# Altium project HAB-Main-Flight-Computer-Card-Template.PrjPcb (part 4 of 4)

## Sheet Power-Supplies.SchDoc
size A2; Organization: Altium Limited; Address1: L3, 12a Rodborough Rd; Address2: Frenchs Forest; Address3: NSW; Address4: Australia 2086
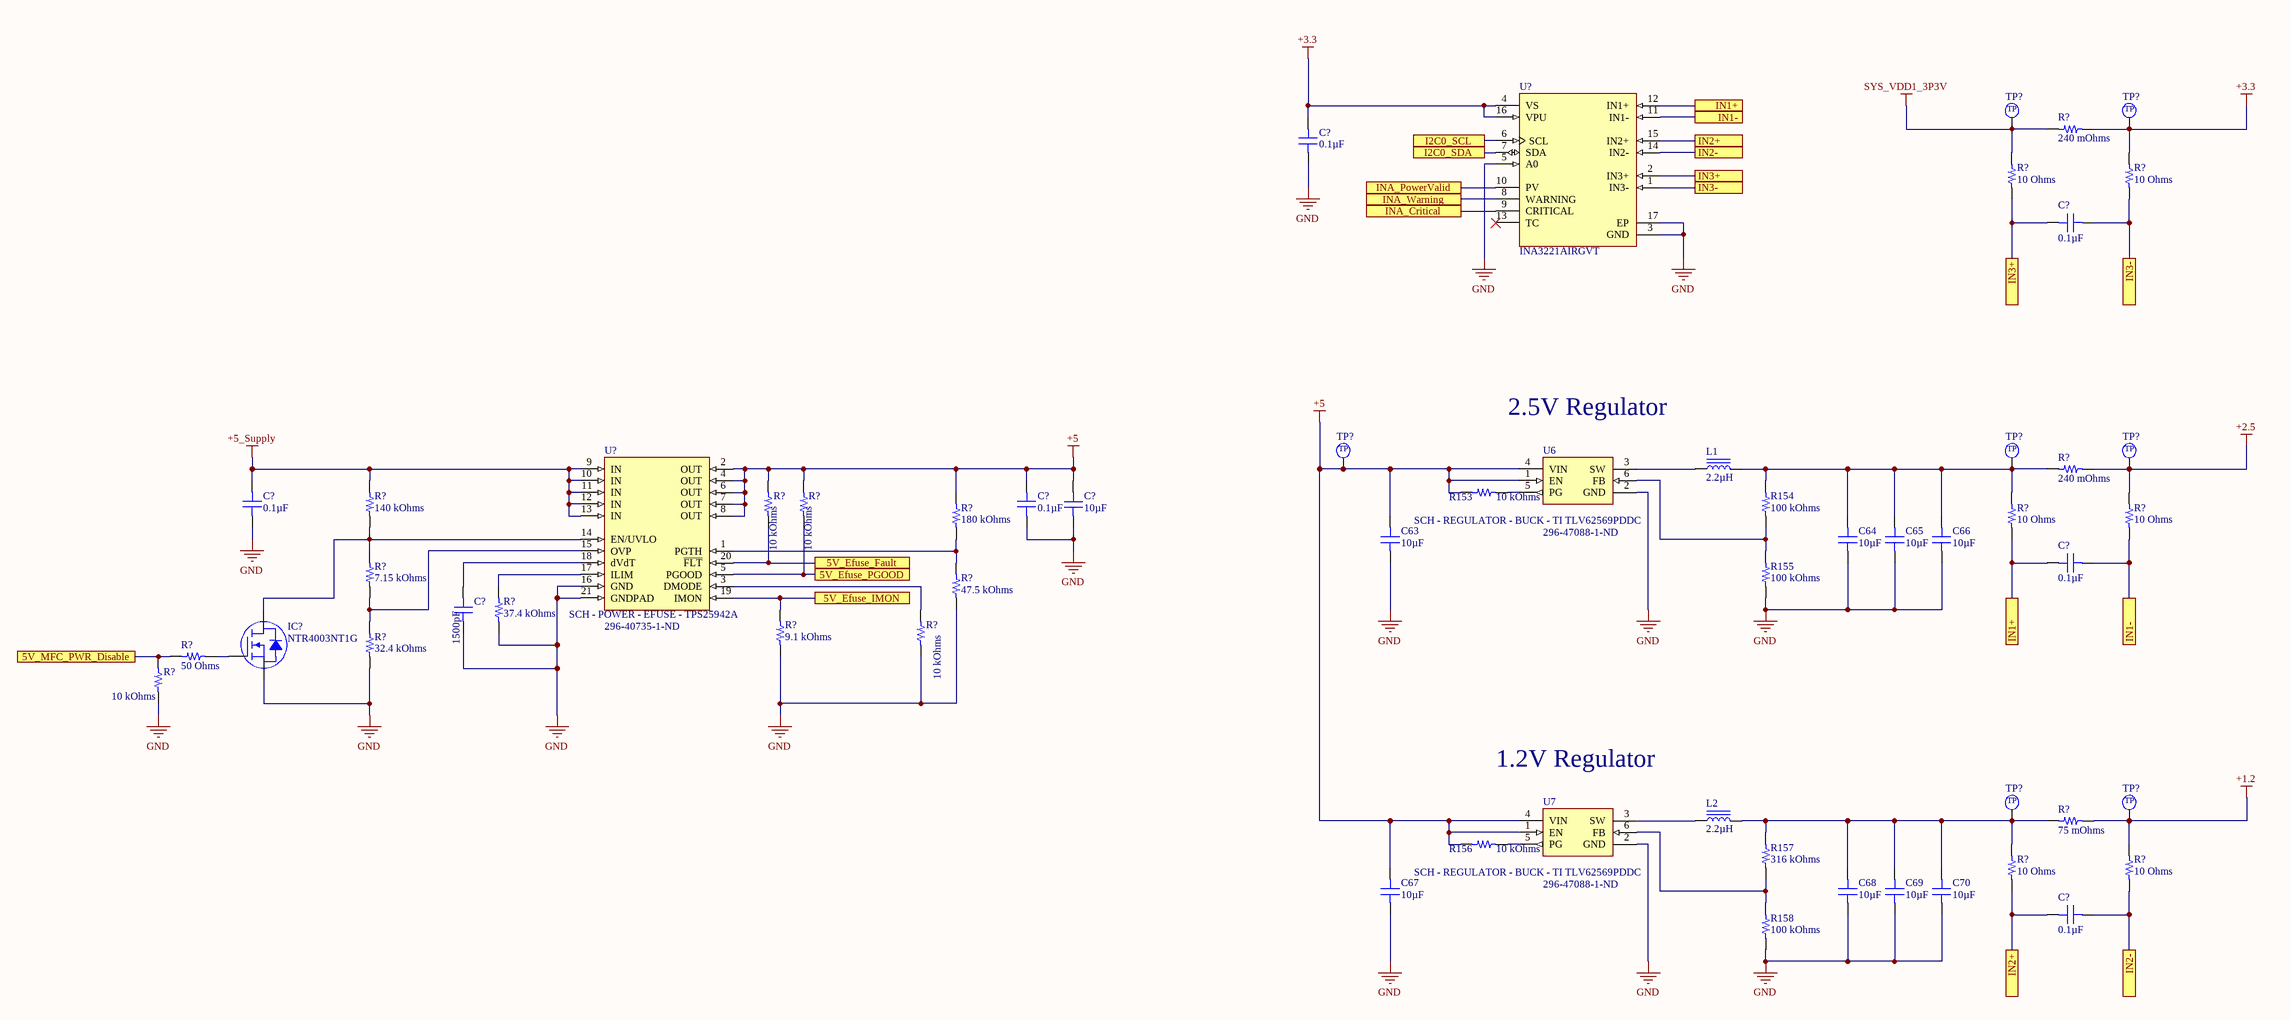
[diagram p8: Power-Supplies.SchDoc]

### Parts
(Parts that share a designator on the sheet are numbered #1, #2 ... from top to bottom, then left to right.)
C63  10µF  [CAP 0805_2012]
C64  10µF  [CAP 0805_2012]
C65  10µF  [CAP 0805_2012]
C66  10µF  [CAP 0805_2012]
C67  10µF  [CAP 0805_2012]
C68  10µF  [CAP 0805_2012]
C69  10µF  [CAP 0805_2012]
C70#2  10µF  [CAP 0805_2012]
C?#9  0.1µF  [CAP 0603_1608]
C?#10  0.1µF  [CAP 0603_1608]
C?#11  0.1µF  [CAP 0603_1608]
C?#12  0.1µF  [CAP 0603_1608]
C?#13  10µF  [CAP 0805_2012]
C?#14  0.1µF  [CAP 0603_1608]
C?#15  1500pF  [CAP 0603_1608]
C?#16  0.1µF  [CAP 0603_1608]
IC?  NTR4003NT1G  [ON SEMI SOT-23-3]
L1  2.2µH  [BOURNS SRN4018]
L2  2.2µH  [BOURNS SRN4018]
R153  10 kOhms  [RES 0603_1608]
R154  100 kOhms  [RES 0603_1608]
R155  100 kOhms  [RES 0603_1608]
R156  10 kOhms  [RES 0603_1608]
R157  316 kOhms  [RES 0603_1608]
R158  100 kOhms  [RES 0603_1608]
R?#10  240 mOhms  [RES 0805_2012]
R?#11  10 Ohms  [RES 0603_1608]
R?#12  10 Ohms  [RES 0603_1608]
R?#13  240 mOhms  [RES 0805_2012]
R?#14  140 kOhms  [RES 0603_1608]
R?#15  10 kOhms  [RES 0603_1608]
R?#16  10 kOhms  [RES 0603_1608]
R?#17  180 kOhms  [RES 0603_1608]
R?#18  10 Ohms  [RES 0603_1608]
R?#19  10 Ohms  [RES 0603_1608]
R?#20  7.15 kOhms  [RES 0603_1608]
R?#21  47.5 kOhms  [RES 0603_1608]
R?#22  37.4 kOhms  [RES 0603_1608]
R?#23  9.1 kOhms  [RES 0603_1608]
R?#24  10 kOhms  [RES 0603_1608]
R?#25  32.4 kOhms  [RES 0603_1608]
R?#26  50 Ohms  [RES 0603_1608]
R?#27  10 kOhms  [RES 0603_1608]
R?#28  75 mOhms  [RES 0805_2012]
R?#29  10 Ohms  [RES 0603_1608]
R?#30  10 Ohms  [RES 0603_1608]
TP?#1  2.5mm_SMD_TestPoint  [2.5mm TestPoint]  (value not drawn)
TP?#2  2.5mm_SMD_TestPoint  [2.5mm TestPoint]  (value not drawn)
TP?#3  2.5mm_SMD_TestPoint  [2.5mm TestPoint]  (value not drawn)
TP?#4  2.5mm_SMD_TestPoint  [2.5mm TestPoint]  (value not drawn)
TP?#5  2.5mm_SMD_TestPoint  [2.5mm TestPoint]  (value not drawn)
TP?#6  2.5mm_SMD_TestPoint  [2.5mm TestPoint]  (value not drawn)
TP?#7  2.5mm_SMD_TestPoint  [2.5mm TestPoint]  (value not drawn)
U6  SCH - REGULATOR - BUCK - TI TLV62569PDDC  Supplier Part Number 1: 296-47088-1-ND  [PCB - LEADS - SOT- TI TSOT-23-6]
U7  SCH - REGULATOR - BUCK - TI TLV62569PDDC  Supplier Part Number 1: 296-47088-1-ND  [PCB - LEADS - SOT- TI TSOT-23-6]
U?#2  INA3221AIRGVT  [RGV0016A_V]
U?#3  SCH - POWER - EFUSE - TPS25942A  Supplier Part Number 1: 296-40735-1-ND  [PCB - LEADLESS - QFN - TI 20-WQFN]

### Ports
5V_Efuse_Fault, 5V_Efuse_IMON, 5V_Efuse_PGOOD, 5V_MFC_PWR_Disable, I2C0_SCL, I2C0_SDA, IN1+, IN1-, IN2+, IN2-, IN3+, IN3-, INA_Critical, INA_PowerValid, INA_Warning

### Nets
+1.2: R?#28.2 R?#30.2 TP?#7.1
+2.5: R?#13.2 R?#19.2 TP?#5.1
+3.3: C?#9.2 R?#10.2 R?#12.2 TP?#2.1 U?#2.4(VS) U?#2.16(VPU)
+5: C63.2 C67.2 C?#12.2 C?#13.2 R153.2 R156.2 R?#15.2 R?#16.2 R?#17.2 TP?#3.1 U6.1(EN) U6.4(VIN) U7.1(EN) U7.4(VIN) U?#3.2(OUT) U?#3.4(OUT) U?#3.6(OUT) U?#3.7(OUT) U?#3.8(OUT)
+5_Supply: C?#11.2 R?#14.2 U?#3.9(IN) U?#3.10(IN) U?#3.11(IN) U?#3.12(IN) U?#3.13(IN)
GND: C63.1 C64.1 C65.1 C66.1 C67.1 C68.1 C69.1 C70#2.1 C?#9.1 C?#11.1 C?#12.1 C?#13.1 C?#15.1 IC?.2(S) R155.1 R158.1 R?#21.1 R?#22.1 R?#23.1 R?#24.1 R?#25.1 R?#27.1 U6.2(GND) U7.2(GND) U?#2.3(GND) U?#2.5(A0) U?#2.17(EP) U?#3.16(GND) U?#3.21(GNDPAD)
SYS_VDD1_3P3V: R?#10.1 R?#11.2 TP?#1.1
NetC64_2: C64.2 C65.2 C66.2 L1.2 R154.2 R?#13.1 R?#18.2 TP?#4.1
NetC68_2: C68.2 C69.2 C70#2.2 L2.2 R157.2 R?#28.1 R?#29.2 TP?#6.1
NetC?#10_1: C?#10.1 R?#12.1 U?#2.1(IN3-) ; port IN3-
NetC?#10_2: C?#10.2 R?#11.1 U?#2.2(IN3+) ; port IN3+
NetC?#14_1: C?#14.1 R?#19.1 U?#2.11(IN1-) ; port IN1-
NetC?#14_2: C?#14.2 R?#18.1 U?#2.12(IN1+) ; port IN1+
NetC?#15_2: C?#15.2 U?#3.18(dVdT)
NetC?#16_1: C?#16.1 R?#30.1 U?#2.14(IN2-) ; port IN2-
NetC?#16_2: C?#16.2 R?#29.1 U?#2.15(IN2+) ; port IN2+
NetIC?_1: IC?.1(G) R?#26.1
NetIC?_3: IC?.3(D) R?#14.1 R?#20.2 U?#3.14(EN/UVLO)
NetL1_1: L1.1 U6.3(SW)
NetL2_1: L2.1 U7.3(SW)
NetR153_1: R153.1 U6.5(PG)
NetR154_1: R154.1 R155.2 U6.6(FB)
NetR156_1: R156.1 U7.5(PG)
NetR157_1: R157.1 R158.2 U7.6(FB)
NetR?#15_1: R?#15.1 U?#3.20(~{FLT}) ; port 5V_Efuse_Fault
NetR?#16_1: R?#16.1 U?#3.5(PGOOD) ; port 5V_Efuse_PGOOD
NetR?#17_1: R?#17.1 R?#21.2 U?#3.1(PGTH)
NetR?#20_1: R?#20.1 R?#25.2 U?#3.15(OVP)
NetR?#22_2: R?#22.2 U?#3.17(ILIM)
NetR?#23_2: R?#23.2 U?#3.19(IMON) ; port 5V_Efuse_IMON
NetR?#24_2: R?#24.2 U?#3.3(DMODE)
NetR?#26_2: R?#26.2 R?#27.2 ; port 5V_MFC_PWR_Disable
NetU?#2_6: U?#2.6(SCL) ; port I2C0_SCL
NetU?#2_7: U?#2.7(SDA) ; port I2C0_SDA
NetU?#2_8: U?#2.8(WARNING) ; port INA_Warning
NetU?#2_9: U?#2.9(CRITICAL) ; port INA_Critical
NetU?#2_10: U?#2.10(PV) ; port INA_PowerValid

Not connected (* = marked no-connect by the designer): U?#2 13(TC)*

### Notes on the sheet
- 2.5V Regulator
- 1.2V Regulator
- Title
- Size:
- Date:
- File:
- A2
- Number:
- Time:
- Revision:
- Sheet
- of
- (in symbol 2.5mm_SMD_TestPoint) TP

### Library data of the parts
C63-C69 C70#2 C?#13 = CC0805KKX5R7BB106: CAP CER 10UF 16V X5R 0805; Manufacturer: Yageo; Tolerance: ±10%; Part Number: CC0805KKX5R7BB106; Value: 10µF; Applications: General Purpose; Capacitance: 10µF; ComponentLink1Description: Datasheet; ComponentLink1URL: https://www.yageo.com/upload/media/product/productsearch/datasheet/mlcc/UPY-GPHC_X5R_4V-to-50V_25.pdf; ComponentLink2Description: DigiKey Link; ComponentLink2URL: http://digikey.com/product-detail/en/yageo/CC0805KKX5R7BB106/311-1865-1-ND/5195767; Device Package: 0805 (2012 Metric); LastUpdated: 9/2/2020 1:04:30 AM; Lifecycle Status: Active; Minimum Order: 1; Mounting Type: Surface Mount, MLCC; Operating Temperature: -55°C ~ 85°C; Package / Case: 0805 (2012 Metric); Packaging: TapeAndReel; PartId: 8867; Part Status: Active; Price: 0.09; Series: CC; Size / Dimension: 0.079" L x 0.049" W (2.00mm x 1.25mm); Supplier 1: DigiKey; Supplier Part Number 1: 311-1865-1-ND; Temperature Coefficient: X5R; Thickness (Max): 0.057" (1.45mm); Voltage - Rated: 16V
C?#9-C?#12 C?#14 C?#16 = CL10B104KA8WPNC: CAP CER 0.1UF 25V X7R 0603; Manufacturer: Samsung Electro-Mechanics; Tolerance: ±10%; Part Number: CL10B104KA8WPNC; Value: 0.1µF; Applications: Automotive; Capacitance: 0.1µF; ComponentLink1Description: Datasheet; ComponentLink1URL: http://www.samsungsem.com/kr/support/product-search/mlcc/CL10B104KA8WPNC.jsp; ComponentLink2Description: DigiKey Link; ComponentLink2URL: http://digikey.com/product-detail/en/samsung-electro-mechanics/CL10B104KA8WPNC/1276-6717-1-ND/5961576; Device Package: 0603 (1608 Metric); Features: Open Mode; LastUpdated: 9/2/2020 1:03:30 AM; Lifecycle Status: Active; Minimum Order: 1; Mounting Type: Surface Mount, MLCC; Operating Temperature: -55°C ~ 125°C; Package / Case: 0603 (1608 Metric); Packaging: TapeAndReel; PartId: 5631; Part Status: Active; Price: 0.02; Ratings: AEC-Q200; Series: CL; Size / Dimension: 0.063" L x 0.031" W (1.60mm x 0.80mm); Supplier 1: DigiKey; Supplier Part Number 1: 1276-6717-1-ND; Temperature Coefficient: X7R; Thickness (Max): 0.035" (0.90mm); Voltage - Rated: 25V
C?#15 = CC0603JRX7R8BB152: CAP CER 1500PF 25V X7R 0603; Manufacturer: Yageo; Tolerance: ±5%; Part Number: CC0603JRX7R8BB152; Value: 1500pF; Applications: General Purpose; Capacitance: 1500pF; ComponentLink1Description: Datasheet; ComponentLink1URL: https://www.yageo.com/upload/media/product/productsearch/datasheet/mlcc/UPY-GPHC_X7R_6.3V-to-50V_18.pdf; ComponentLink2Description: DigiKey Link; ComponentLink2URL: http://digikey.com/product-detail/en/yageo/CC0603JRX7R8BB152/311-3996-1-ND/8025085; Device Package: 0603 (1608 Metric); LastUpdated: 9/2/2020 1:03:18 AM; Lifecycle Status: Active; Minimum Order: 1; Mounting Type: Surface Mount, MLCC; Operating Temperature: -55°C ~ 125°C; Package / Case: 0603 (1608 Metric); Packaging: TapeAndReel; PartId: 12307; Part Status: Active; Price: 0.02; Series: CC; Size / Dimension: 0.063" L x 0.031" W (1.60mm x 0.80mm); Supplier 1: DigiKey; Supplier Part Number 1: 311-3996-1-ND; Temperature Coefficient: X7R; Thickness (Max): 0.035" (0.90mm); Voltage - Rated: 25V
IC? = NTR4003NT1G: MOSFET N-CH 30V 500MA SOT-23; Manufacturer: ON Semiconductor; Current - Continuous Drain (Id) @ 25°C: 500mA (Ta); Drive Voltage (Max Rds On,  Min Rds On): 2.5V, 4V; FET Type: N-Channel; Gate Charge (Qg) (Max) @ Vgs: 1.15nC @ 5V; Input Capacitance (Ciss) (Max) @ Vds: 21pF @ 5V; Power Dissipation (Max): 690mW (Ta); Rds On (Max) @ Id, Vgs: 1.5Ohm @ 10mA, 4V; Vgs (Max): ±20V; Vgs(th) (Max) @ Id: 1.4V @ 250µA; Part Number: NTR4003NT1G; ComponentLink1Description: Datasheet; ComponentLink1URL: http://www.onsemi.com/pub/Collateral/NTR4003N-D.PDF; ComponentLink2Description: DigiKey Link; ComponentLink2URL: http://digikey.com/product-detail/en/on-semiconductor/NTR4003NT1G/NTR4003NT1GOSCT-ND/1967270; Drain to Source Voltage (Vdss): 30V; LastUpdated: 9/2/2020 1:25:08 AM; Lifecycle Status: Active; Minimum Order: 1; Mounting Type: Surface Mount; Operating Temperature: -55°C ~ 150°C (TJ); Package / Case: TO-236-3, SC-59, SOT-23-3; Packaging: TapeAndReel; Part Status: Active; Price: 0.05; Series: -; Supplier 1: DigiKey; Supplier Part Number 1: NTR4003NT1GOSCT-ND; Supplier Device Package: SOT-23-3 (TO-236); Technology: MOSFET (Metal Oxide)
L1 L2 = SRN4018-2R2M: FIXED IND 2.2UH 2.9A 44 MOHM SMD; Manufacturer: Bourns Inc.; Current - Saturation: 3A; DC Resistance (DCR): 44mOhm Max; Frequency - Self Resonant: 60MHz; Inductance Frequency - Test: 100kHz; Material - Core: Ferrite; Q @ Freq: 9 @ 7.96MHz; Shielding: Semi-Shielded; Tolerance: ±20%; Type: Wirewound; Part Number: SRN4018-2R2M; ComponentLink1Description: Datasheet; ComponentLink1URL: https://www.bourns.com/docs/Product-Datasheets/SRN4018.pdf; ComponentLink2Description: DigiKey Link; ComponentLink2URL: http://digikey.com/product-detail/en/bourns-inc/SRN4018-2R2M/SRN4018-2R2MCT-ND/3821517; Current Rating (Amps): 2.9A; Device Package: Nonstandard; Height - Seated (Max): 0.071" (1.80mm); Inductance: 2.2µH; LastUpdated: 9/2/2020 1:30:23 AM; Lifecycle Status: Active; Minimum Order: 1; Mounting Type: Surface Mount; Operating Temperature: -40°C ~ 125°C; Package / Case: Nonstandard; Packaging: TapeAndReel; PartId: 3660; Part Status: Active; Price: 0.16; Series: SRN4018; Size / Dimension: 0.157" L x 0.157" W (4.00mm x 4.00mm); Supplier 1: DigiKey; Supplier Part Number 1: SRN4018-2R2MCT-ND; Value: 2.2µH
R153 R156 R?#15 R?#16 R?#24 R?#27 = RMCF0603JT10K0: RES 10K OHM 5% 1/10W 0603; Manufacturer: Stackpole Electronics Inc; Power (Watts): 0.1W, 1/10W; Temperature Coefficient: ±200ppm/°C; Part Number: RMCF0603JT10K0; Value: 10 kOhms; ComponentLink1Description: Datasheet; ComponentLink1URL: https://www.seielect.com/catalog/sei-packaging.pdf; ComponentLink2Description: DigiKey Link; ComponentLink2URL: http://digikey.com/product-detail/en/stackpole-electronics-inc/RMCF0603JT10K0/RMCF0603JT10K0CT-ND/1943191; Composition: Thick Film; Device Package: 0603 (1608 Metric); Features: Automotive AEC-Q200; Height - Seated (Max): 0.022" (0.55mm); LastUpdated: 8/30/2020 8:48:45 PM; Lifecycle Status: Active; Minimum Order: 1; Number of Terminations: 2; Operating Temperature: -55°C ~ 155°C; Package / Case: 0603 (1608 Metric); Packaging: CutTape; PartId: 25659; Part Status: Active; Price: 0.10; Ratings: AEC-Q200; Resistance: 10 kOhms; Series: RMCF; Size / Dimension: 0.061" L x 0.031" W (1.55mm x 0.80mm); Supplier 1: DigiKey; Supplier Part Number 1: RMCF0603JT10K0CT-ND; Supplier Device Package: 0603; Tolerance: ±5%
R154 R155 R158 = RMCF0603FT100K: RES 100K OHM 1% 1/10W 0603; Manufacturer: Stackpole Electronics Inc; Power (Watts): 0.1W, 1/10W; Temperature Coefficient: ±100ppm/°C; Part Number: RMCF0603FT100K; Value: 100 kOhms; ComponentLink1Description: Datasheet; ComponentLink1URL: https://www.seielect.com/catalog/sei-packaging.pdf; ComponentLink2Description: DigiKey Link; ComponentLink2URL: http://digikey.com/product-detail/en/stackpole-electronics-inc/RMCF0603FT100K/RMCF0603FT100KCT-ND/1943118; Composition: Thick Film; Device Package: 0603 (1608 Metric); Features: Automotive AEC-Q200; Height - Seated (Max): 0.022" (0.55mm); LastUpdated: 9/2/2020 1:09:31 AM; Lifecycle Status: Active; Minimum Order: 1; Number of Terminations: 2; Operating Temperature: -55°C ~ 155°C; Package / Case: 0603 (1608 Metric); Packaging: CutTape; PartId: 25664; Part Status: Active; Price: 0.10; Ratings: AEC-Q200; Resistance: 100 kOhms; Series: RMCF; Size / Dimension: 0.061" L x 0.031" W (1.55mm x 0.80mm); Supplier 1: DigiKey; Supplier Part Number 1: RMCF0603FT100KCT-ND; Supplier Device Package: 0603; Tolerance: ±1%
R157 = RMCF0603FT316K: RES 316K OHM 1% 1/10W 0603; Manufacturer: Stackpole Electronics Inc; Power (Watts): 0.1W, 1/10W; Temperature Coefficient: ±100ppm/°C; Part Number: RMCF0603FT316K; Value: 316 kOhms; ComponentLink1Description: Datasheet; ComponentLink1URL: https://www.seielect.com/catalog/sei-rmcf_rmcp.pdf; ComponentLink2Description: DigiKey Link; ComponentLink2URL: http://digikey.com/product-detail/en/stackpole-electronics-inc/RMCF0603FT316K/RMCF0603FT316KCT-ND/2418023; Composition: Thick Film; Device Package: 0603 (1608 Metric); Features: Automotive AEC-Q200; Height - Seated (Max): 0.022" (0.55mm); LastUpdated: 9/2/2020 1:09:52 AM; Lifecycle Status: Active; Minimum Order: 1; Number of Terminations: 2; Operating Temperature: -55°C ~ 155°C; Package / Case: 0603 (1608 Metric); Packaging: CutTape; PartId: 19849; Part Status: Active; Price: 0.10; Ratings: AEC-Q200; Resistance: 316 kOhms; Series: RMCF; Size / Dimension: 0.061" L x 0.031" W (1.55mm x 0.80mm); Supplier 1: DigiKey; Supplier Part Number 1: RMCF0603FT316KCT-ND; Supplier Device Package: 0603; Tolerance: ±1%
R?#10 R?#13 = KDV08FR240ET: RES 240M OHM 1% 1/4W 0805; Manufacturer: Ohmite; Power (Watts): 0.25W, 1/4W; Temperature Coefficient: ±50ppm/°C; Part Number: KDV08FR240ET; Value: 240 mOhms; ComponentLink1Description: Datasheet; ComponentLink1URL: https://www.ohmite.com/assets/docs/res_kdv.pdf?r=false; ComponentLink2Description: DigiKey Link; ComponentLink2URL: http://digikey.com/product-detail/en/ohmite/KDV08FR240ET/273-KDV08FR240ETCT-ND/10476983; Composition: Metal Film; Device Package: 0805 (2012 Metric); Features: Current Sense; Height - Seated (Max): 0.026" (0.65mm); LastUpdated: 9/2/2020 1:14:23 AM; Lifecycle Status: Active; Minimum Order: 1; Number of Terminations: 2; Operating Temperature: -55°C ~ 155°C; Package / Case: 0805 (2012 Metric); Packaging: TapeAndReel; PartId: 49831; Part Status: Active; Price: 0.03; Resistance: 240 mOhms; Series: KDV; Size / Dimension: 0.079" L x 0.049" W (2.00mm x 1.25mm); Supplier 1: DigiKey; Supplier Part Number 1: 273-KDV08FR240ETCT-ND; Supplier Device Package: 0805; Tolerance: ±1%
R?#11 R?#12 R?#18 R?#19 R?#29 R?#30 = CRGCQ0603F10R: CRGCQ 0603 10R 1%; Manufacturer: TE Connectivity Passive Product; Power (Watts): 0.1W, 1/10W; Temperature Coefficient: ±400ppm/°C; Part Number: CRGCQ0603F10R; Value: 10 Ohms; ComponentLink1Description: Datasheet; ComponentLink1URL: https://www.te.com/commerce/DocumentDelivery/DDEController?Action=srchrtrv&DocNm=1773204-3&DocType=DS&DocLang=English; ComponentLink2Description: DigiKey Link; ComponentLink2URL: http://digikey.com/product-detail/en/te-connectivity-passive-product/CRGCQ0603F10R/A129664CT-ND/8577496; Composition: Thick Film; Device Package: 0603 (1608 Metric); Features: Automotive AEC-Q200, Moisture Resistant; Height - Seated (Max): 0.022" (0.55mm); LastUpdated: 9/2/2020 1:09:39 AM; Lifecycle Status: Active; Minimum Order: 1; Number of Terminations: 2; Operating Temperature: -55°C ~ 155°C; Package / Case: 0603 (1608 Metric); Packaging: CutTape; PartId: 23975; Part Status: Active; Price: 0.10; Ratings: AEC-Q200; Resistance: 10 Ohms; Series: CRGCQ; Size / Dimension: 0.063" L x 0.031" W (1.60mm x 0.80mm); Supplier 1: DigiKey; Supplier Part Number 1: A129664CT-ND; Supplier Device Package: 0603; Tolerance: ±1%
R?#14 = RT0603BRE07140KL: RES SMD 140K OHM 0.1% 1/10W 0603; Manufacturer: Yageo; Power (Watts): 0.1W, 1/10W; Temperature Coefficient: ±50ppm/°C; Part Number: RT0603BRE07140KL; Value: 140 kOhms; ComponentLink1Description: Datasheet; ComponentLink1URL: https://www.yageo.com/upload/media/product/productsearch/datasheet/rchip/PYu-RT_1-to-0.01_RoHS_L_11.pdf; ComponentLink2Description: DigiKey Link; ComponentLink2URL: http://digikey.com/product-detail/en/yageo/RT0603BRE07140KL/YAG4626CT-ND/6616782; Composition: Thin Film; Device Package: 0603 (1608 Metric); Height - Seated (Max): 0.022" (0.55mm); LastUpdated: 9/2/2020 1:09:47 AM; Lifecycle Status: Active; Minimum Order: 1; Number of Terminations: 2; Operating Temperature: -55°C ~ 155°C; Package / Case: 0603 (1608 Metric); Packaging: TapeAndReel; PartId: 22168; Part Status: Active; Price: 0.05; Resistance: 140 kOhms; Series: RT; Size / Dimension: 0.063" L x 0.031" W (1.60mm x 0.80mm); Supplier 1: DigiKey; Supplier Part Number 1: YAG4626CT-ND; Supplier Device Package: 0603; Tolerance: ±0.1%
R?#17 = RMCF0603FT180K: RES 180K OHM 1% 1/10W 0603; Manufacturer: Stackpole Electronics Inc; Power (Watts): 0.1W, 1/10W; Temperature Coefficient: ±100ppm/°C; Part Number: RMCF0603FT180K; Value: 180 kOhms; ComponentLink1Description: Datasheet; ComponentLink1URL: https://www.seielect.com/catalog/sei-rmcf_rmcp.pdf; ComponentLink2Description: DigiKey Link; ComponentLink2URL: http://digikey.com/product-detail/en/stackpole-electronics-inc/RMCF0603FT180K/RMCF0603FT180KCT-ND/5049744; Composition: Thick Film; Device Package: 0603 (1608 Metric); Features: Automotive AEC-Q200; Height - Seated (Max): 0.022" (0.55mm); LastUpdated: 9/2/2020 1:10:00 AM; Lifecycle Status: Active; Minimum Order: 1; Number of Terminations: 2; Operating Temperature: -55°C ~ 155°C; Package / Case: 0603 (1608 Metric); Packaging: CutTape; PartId: 16499; Part Status: Active; Price: 0.10; Ratings: AEC-Q200; Resistance: 180 kOhms; Series: RMCF; Size / Dimension: 0.061" L x 0.031" W (1.55mm x 0.80mm); Supplier 1: DigiKey; Supplier Part Number 1: RMCF0603FT180KCT-ND; Supplier Device Package: 0603; Tolerance: ±1%
R?#20 = ERJ-PB3B7151V: RES SMD 7.15K OHM 0.1% 1/5W 0603; Manufacturer: Panasonic Electronic Components; Power (Watts): 0.2W, 1/5W; Temperature Coefficient: ±50ppm/°C; Part Number: ERJ-PB3B7151V; Value: 7.15 kOhms; ComponentLink1Description: Datasheet; ComponentLink1URL: https://industrial.panasonic.com/cdbs/www-data/pdf/RDM0000/AOA0000C328.pdf; ComponentLink2Description: DigiKey Link; ComponentLink2URL: http://digikey.com/product-detail/en/panasonic-electronic-components/ERJ-PB3B7151V/P20070CT-ND/6214325; Composition: Thick Film; Device Package: 0603 (1608 Metric); Features: Automotive AEC-Q200, Pulse Withstanding; Height - Seated (Max): 0.022" (0.55mm); LastUpdated: 9/2/2020 1:10:22 AM; Lifecycle Status: Active; Minimum Order: 1; Number of Terminations: 2; Operating Temperature: -55°C ~ 155°C; Package / Case: 0603 (1608 Metric); Packaging: TapeAndReel; PartId: 6380; Part Status: Active; Price: 0.03; Ratings: AEC-Q200; Resistance: 7.15 kOhms; Series: ERJ; Size / Dimension: 0.063" L x 0.031" W (1.60mm x 0.80mm); Supplier 1: DigiKey; Supplier Part Number 1: P20070CT-ND; Supplier Device Package: 0603; Tolerance: ±0.1%
R?#21 = RMCF0603FG47K5: RES 47.5K OHM 1% 1/10W 0603; Manufacturer: Stackpole Electronics Inc; Power (Watts): 0.1W, 1/10W; Temperature Coefficient: ±100ppm/°C; Part Number: RMCF0603FG47K5; Value: 47.5 kOhms; ComponentLink1Description: Datasheet; ComponentLink1URL: https://www.seielect.com/catalog/sei-packaging.pdf; ComponentLink2Description: DigiKey Link; ComponentLink2URL: http://digikey.com/product-detail/en/stackpole-electronics-inc/RMCF0603FG47K5/RMCF0603FG47K5CT-ND/4425046; Composition: Thick Film; Device Package: 0603 (1608 Metric); Features: Automotive AEC-Q200; Height - Seated (Max): 0.022" (0.55mm); LastUpdated: 9/2/2020 1:09:32 AM; Lifecycle Status: Active; Minimum Order: 1; Number of Terminations: 2; Operating Temperature: -55°C ~ 155°C; Package / Case: 0603 (1608 Metric); Packaging: CutTape; PartId: 25458; Part Status: Active; Price: 0.10; Ratings: AEC-Q200; Resistance: 47.5 kOhms; Series: RMCF; Size / Dimension: 0.061" L x 0.031" W (1.55mm x 0.80mm); Supplier 1: DigiKey; Supplier Part Number 1: RMCF0603FG47K5CT-ND; Supplier Device Package: 0603; Tolerance: ±1%
R?#22 = RNCP0603FTD37K4: RES 37.4K OHM 1% 1/8W 0603; Manufacturer: Stackpole Electronics Inc; Power (Watts): 0.125W, 1/8W; Temperature Coefficient: ±100ppm/°C; Part Number: RNCP0603FTD37K4; Value: 37.4 kOhms; ComponentLink1Description: Datasheet; ComponentLink1URL: https://www.seielect.com/catalog/sei-rncp.pdf; ComponentLink2Description: DigiKey Link; ComponentLink2URL: http://digikey.com/product-detail/en/stackpole-electronics-inc/RNCP0603FTD37K4/RNCP0603FTD37K4CT-ND/2240497; Composition: Thin Film; Device Package: 0603 (1608 Metric); Features: Anti-Sulfur, Moisture Resistant; Height - Seated (Max): 0.020" (0.50mm); LastUpdated: 9/2/2020 1:09:56 AM; Lifecycle Status: Active; Minimum Order: 1; Number of Terminations: 2; Operating Temperature: -55°C ~ 155°C; Package / Case: 0603 (1608 Metric); Packaging: TapeAndReel; PartId: 18402; Part Status: Active; Price: 0.01; Resistance: 37.4 kOhms; Series: RNCP; Size / Dimension: 0.059" L x 0.031" W (1.50mm x 0.80mm); Supplier 1: DigiKey; Supplier Part Number 1: RNCP0603FTD37K4CT-ND; Supplier Device Package: 0603; Tolerance: ±1%
R?#23 = RMCF0603FT9K10: RES 9.1K OHM 1% 1/10W 0603; Manufacturer: Stackpole Electronics Inc; Power (Watts): 0.1W, 1/10W; Temperature Coefficient: ±100ppm/°C; Part Number: RMCF0603FT9K10; Value: 9.1 kOhms; ComponentLink1Description: Datasheet; ComponentLink1URL: https://www.seielect.com/catalog/sei-rmcf_rmcp.pdf; ComponentLink2Description: DigiKey Link; ComponentLink2URL: http://digikey.com/product-detail/en/stackpole-electronics-inc/RMCF0603FT9K10/RMCF0603FT9K10CT-ND/6052977; Composition: Thick Film; Device Package: 0603 (1608 Metric); Features: Automotive AEC-Q200; Height - Seated (Max): 0.022" (0.55mm); LastUpdated: 9/2/2020 1:10:11 AM; Lifecycle Status: Active; Minimum Order: 1; Number of Terminations: 2; Operating Temperature: -55°C ~ 155°C; Package / Case: 0603 (1608 Metric); Packaging: CutTape; PartId: 11761; Part Status: Active; Price: 0.10; Ratings: AEC-Q200; Resistance: 9.1 kOhms; Series: RMCF; Size / Dimension: 0.061" L x 0.031" W (1.55mm x 0.80mm); Supplier 1: DigiKey; Supplier Part Number 1: RMCF0603FT9K10CT-ND; Supplier Device Package: 0603; Tolerance: ±1%
R?#25 = ERJ-PB3B3242V: RES SMD 32.4K OHM 0.1% 1/5W 0603; Manufacturer: Panasonic Electronic Components; Power (Watts): 0.2W, 1/5W; Temperature Coefficient: ±50ppm/°C; Part Number: ERJ-PB3B3242V; Value: 32.4 kOhms; ComponentLink1Description: Datasheet; ComponentLink1URL: https://industrial.panasonic.com/cdbs/www-data/pdf/RDM0000/AOA0000C328.pdf; ComponentLink2Description: DigiKey Link; ComponentLink2URL: http://digikey.com/product-detail/en/panasonic-electronic-components/ERJ-PB3B3242V/P20142CT-ND/6214397; Composition: Thick Film; Device Package: 0603 (1608 Metric); Features: Automotive AEC-Q200, Pulse Withstanding; Height - Seated (Max): 0.022" (0.55mm); LastUpdated: 9/2/2020 1:10:06 AM; Lifecycle Status: Active; Minimum Order: 1; Number of Terminations: 2; Operating Temperature: -55°C ~ 155°C; Package / Case: 0603 (1608 Metric); Packaging: TapeAndReel; PartId: 13586; Part Status: Active; Price: 0.03; Ratings: AEC-Q200; Resistance: 32.4 kOhms; Series: ERJ; Size / Dimension: 0.063" L x 0.031" W (1.60mm x 0.80mm); Supplier 1: DigiKey; Supplier Part Number 1: P20142CT-ND; Supplier Device Package: 0603; Tolerance: ±0.1%
R?#26 = CRCW060350R0FKEA: RES SMD 50 OHM 1% 1/10W 0603; Manufacturer: Vishay Dale; Power (Watts): 0.1W, 1/10W; Temperature Coefficient: ±100ppm/°C; Part Number: CRCW060350R0FKEA; Value: 50 Ohms; ComponentLink1Description: Datasheet; ComponentLink1URL: http://www.vishay.com/docs/20035/dcrcwe3.pdf; ComponentLink2Description: DigiKey Link; ComponentLink2URL: http://digikey.com/product-detail/en/vishay-dale/CRCW060350R0FKEA/541-3318-1-ND/6684924; Composition: Thick Film; Device Package: 0603 (1608 Metric); Features: Automotive AEC-Q200; Height - Seated (Max): 0.020" (0.50mm); LastUpdated: 9/2/2020 1:09:40 AM; Lifecycle Status: Active; Minimum Order: 1; Number of Terminations: 2; Operating Temperature: -55°C ~ 155°C; Package / Case: 0603 (1608 Metric); Packaging: CutTape; PartId: 23780; Part Status: Active; Price: 0.10; Ratings: AEC-Q200; Resistance: 50 Ohms; Series: CRCW; Size / Dimension: 0.061" L x 0.033" W (1.55mm x 0.85mm); Supplier 1: DigiKey; Supplier Part Number 1: 541-3318-1-ND; Supplier Device Package: 0603; Tolerance: ±1%
R?#28 = ERJ-L06UF75MV: RES 0.075 OHM 1% 1/4W 0805; Manufacturer: Panasonic Electronic Components; Power (Watts): 0.25W, 1/4W; Temperature Coefficient: ±100ppm/°C; Part Number: ERJ-L06UF75MV; Value: 75 mOhms; ComponentLink1Description: Datasheet; ComponentLink1URL: https://industrial.panasonic.com/cdbs/www-data/pdf/RDN0000/AOA0000C313.pdf; ComponentLink2Description: DigiKey Link; ComponentLink2URL: http://digikey.com/product-detail/en/panasonic-electronic-components/ERJ-L06UF75MV/P75LLCT-ND/966124; Composition: Thick Film; Device Package: 0805 (2012 Metric); Features: Automotive AEC-Q200, Current Sense; Height - Seated (Max): 0.028" (0.70mm); LastUpdated: 9/2/2020 1:15:15 AM; Lifecycle Status: Active; Minimum Order: 1; Number of Terminations: 2; Operating Temperature: -55°C ~ 125°C; Package / Case: 0805 (2012 Metric); Packaging: TapeAndReel; PartId: 31851; Part Status: Active; Price: 0.09; Ratings: AEC-Q200; Resistance: 75 mOhms; Series: ERJ; Size / Dimension: 0.079" L x 0.049" W (2.00mm x 1.25mm); Supplier 1: DigiKey; Supplier Part Number 1: P75LLCT-ND; Supplier Device Package: 0805; Tolerance: ±1%
U?#2 = CMP-0704-00002-2: Triple Channel Shunt and Bus Voltage Monitor, 120 dB, 2.7 to 5.5 V, -40 to 125 degC, 16-Pin VQFN (RGV), Green (RoHS & no Sb/Br), Tape and Reel; Manufacturer: Texas Instruments; Voltage Input Range (Bus): 0 to 26 V; Gain Error (max): 0.25%; Gain: 1 V/V; CMR (Typ): 120 dB; Offset Voltage (max): +/- 80 uV; Rating: Catalog; Quiescent Current (Typ): 350 uA; Mounting Technology: Surface Mount; PackageReference: RGV0016A; PackageDescription: 16-Pin Quad Flat No-lead Package, Body 4 x 4 mm, Pitch 0.65 mm; ComponentLink3Description: Package Specification; RoHS: TRUE; ComponentLink3URL: http://www.ti.com/lit/ds/symlink/ina3221.pdf; Packing: Tape and Reel; ComponentLink2URL: http://www.ti.com/lit/ds/symlink/ina3221.pdf; Operating Supply Range: 2.7 to 5.5 V; PackageVersion: SBOS576A; ComponentLink1Description: Manufacturer URL; DatasheetVersion: SBOS576A; ComponentLink1URL: http://www.ti.com/; Temperature Range: -40 to 125 degC; PartNumber: INA3221AIRGVT; ComponentLink2Description: Datasheet
U6 U7 = SCH - REGULATOR - BUCK - TI TLV62569PDDC: Supplier 1: Digi-Key
U?#3 = SCH - POWER - EFUSE - TPS25942A: Supplier 1: Digi-Key

## Nets that join several sheets
+1.2: NetworkSwitch (38 pins), EthernetBridge (15 pins), Power-Supplies (R?#28.2 R?#30.2 TP?#7.1)
+2.5: Interfaces (30 pins), NetworkSwitch (15 pins), EthernetBridge (8 pins), Power-Supplies (R?#13.2 R?#19.2 TP?#5.1)
+3.3: Interfaces (10 pins), CANbus (C12.2 C16.2 U4.5 U5#1.18), NetworkSwitch (30 pins), EthernetBridge (27 pins), ComputeModule (11 pins), Sensors (C?#6.2 U?#1.8), Power-Supplies (6 pins)
+5: CANbus (C13.2 U4.3), ComputeModule (10 pins), Power-Supplies (19 pins)
+5_Supply: Interfaces (5 pins), Power-Supplies (7 pins)
GND: Interfaces (60 pins), CANbus (13 pins), NetworkSwitch (54 pins), EthernetBridge (35 pins), ComputeModule (58 pins), Sensors (9 pins), Power-Supplies (29 pins)
ETH1_RX_N: Interfaces (J4.4 R32.1), ComputeModule (U1#2.6)
ETH1_RX_P: Interfaces (J4.3 R31.1), ComputeModule (U1#2.4)
ETH1_TX_N: Interfaces (J4.2 R30.1), ComputeModule (U1#2.10)
ETH1_TX_P: Interfaces (J4.1 R29.1), ComputeModule (U1#2.12)
ETH2_RX_N: Interfaces (J4.10 R36.1), NetworkSwitch (U5#2.5)
ETH2_RX_P: Interfaces (J4.9 R35.1), NetworkSwitch (U5#2.4)
ETH2_TX_N: Interfaces (J4.8 R34.1), NetworkSwitch (U5#2.2)
ETH2_TX_P: Interfaces (J4.7 R33.1), NetworkSwitch (U5#2.1)
ETH3_RX_N: Interfaces (J4.16 R40.1), NetworkSwitch (U5#2.16)
ETH3_RX_P: Interfaces (J4.15 R39.1), NetworkSwitch (U5#2.15)
ETH3_TX_N: Interfaces (J4.14 R38.1), NetworkSwitch (U5#2.13)
ETH3_TX_P: Interfaces (J4.13 R37.1), NetworkSwitch (U5#2.12)
ETH4_RX_N: Interfaces (J4.22 R44.1), NetworkSwitch (U5#2.27)
ETH4_RX_P: Interfaces (J4.21 R43.1), NetworkSwitch (U5#2.26)
ETH4_TX_N: Interfaces (J4.20 R42.1), NetworkSwitch (U5#2.25)
ETH4_TX_P: Interfaces (J4.19 R41.1), NetworkSwitch (U5#2.24)
ETH5_RX_N: Interfaces (J4.28 R48#1.1), NetworkSwitch (U5#2.38)
ETH5_RX_P: Interfaces (J4.27 R47#1.1), NetworkSwitch (U5#2.37)
ETH5_TX_N: Interfaces (J4.26 R46.1), NetworkSwitch (U5#2.35)
ETH5_TX_P: Interfaces (J4.25 R45.1), NetworkSwitch (U5#2.34)
ETH6_RX_N: Interfaces (J4.34 R52.1), NetworkSwitch (U5#2.116)
ETH6_RX_P: Interfaces (J4.33 R51.1), NetworkSwitch (U5#2.115)
ETH6_TX_N: Interfaces (J4.32 R50#1.1), NetworkSwitch (U5#2.113)
ETH6_TX_P: Interfaces (J4.31 R49#1.1), NetworkSwitch (U5#2.112)
NetD2_1: Interfaces (J1.10), CANbus (D2.1 R49#2.1 U4.6)
NetD2_2: Interfaces (J1.9), CANbus (D2.2 R47#2.2 U4.7)
NetJ1_13: Interfaces (J1.13), ComputeModule (U1#2.48)
NetJ1_14: Interfaces (J1.14 R9.2), ComputeModule (U1#2.50)
NetJ1_15: Interfaces (J1.15 R10.2), ComputeModule (U1#2.36)
NetJ1_16: Interfaces (J1.16 R11.2), ComputeModule (U1#2.46)
NetJ1_17: Interfaces (J1.17 R12.2), ComputeModule (U1#2.34)
NetJ1_18: Interfaces (J1.18 R13.2), ComputeModule (U1#2.30)
NetJ1_19: Interfaces (J1.19 R14.2), ComputeModule (U1#2.28)
NetJ1_20: Interfaces (J1.20 R15.2), ComputeModule (U1#2.26)
NetJ1_21: Interfaces (J1.21 R16.2), ComputeModule (U1#2.24)
NetJ1_22: Interfaces (J1.22 R17.2), ComputeModule (U1#2.55)
NetJ1_23: Interfaces (J1.23 R18.2), ComputeModule (U1#2.51)
NetJ1_24: Interfaces (J1.24 R19.2), ComputeModule (U1#2.49)
NetJ1_25: Interfaces (J1.25 R20.2), ComputeModule (U1#2.47)
NetJ1_26: Interfaces (J1.26 R21.2), ComputeModule (U1#2.45)
NetJ1_27: Interfaces (J1.27 R22.2), ComputeModule (U1#2.41)
NetJ1_28: Interfaces (J1.28 R23.2), ComputeModule (U1#2.37)
NetJ1_29: Interfaces (J1.29 R24.2), ComputeModule (U1#2.35)
NetJ1_30: Interfaces (J1.30 R25.2), ComputeModule (U1#2.31)
NetJ1_31: Interfaces (J1.31 R26.2), ComputeModule (U1#2.27)
NetJ1_32: Interfaces (J1.32 R27.2), ComputeModule (U1#2.29)
NetJ1_33: Interfaces (J1.33 R28.2), ComputeModule (U1#2.25)
NetR48#2_2: CANbus (R48#2.2), ComputeModule (U1#2.54)
NetR62_2: NetworkSwitch (R122#1.1), EthernetBridge (R62.2)
NetR63_2: NetworkSwitch (R123#1.1), EthernetBridge (R63.2)
NetR64_2: NetworkSwitch (R125#1.1), EthernetBridge (R64.2)
NetR65_2: NetworkSwitch (R126#1.1), EthernetBridge (R65.2)
NetR117_1: NetworkSwitch (R117.1 U5#2.95), EthernetBridge (U16.41)
NetR121#2_1: ComputeModule (R121#2.1 U1#2.82 U12.6), Sensors (U?#1.9)
NetR122#2_1: ComputeModule (R122#2.1 U1#2.80 U12.7), Sensors (U?#1.10)
NetR129#1_1: NetworkSwitch (R129#1.1 R150.2), EthernetBridge (U16.15)
NetR130#1_1: NetworkSwitch (R130#1.1 R149.2), EthernetBridge (U16.16)
NetR131#1_1: NetworkSwitch (R131#1.1 R148.2), EthernetBridge (U16.17)
NetR131#2_1: NetworkSwitch (U5#2.100), EthernetBridge (R131#2.1 U16.63)
NetR132#1_1: NetworkSwitch (R132#1.1 R147#1.2), EthernetBridge (U16.18)
NetR133#1_1: NetworkSwitch (R133#1.1), EthernetBridge (U16.22)
NetR134#1_1: NetworkSwitch (R134#1.1), EthernetBridge (U16.23)
NetR135#1_1: NetworkSwitch (R135#1.1), EthernetBridge (U16.11)
NetR135#2_1: EthernetBridge (R135#2.1 U16.44), ComputeModule (U14.4)
NetR136_1: NetworkSwitch (R136.1), EthernetBridge (U16.10)
NetR137_1: NetworkSwitch (R137.1 R152.2), EthernetBridge (U16.20)
NetR138_1: NetworkSwitch (R138.1 R151.2), EthernetBridge (U16.14)
NetR139_1: NetworkSwitch (R139.1), EthernetBridge (U16.13)
NetR?#15_1: ComputeModule (U1#2.56), Power-Supplies (R?#15.1 U?#3.20)
NetR?#26_2: ComputeModule (U1#2.58), Power-Supplies (R?#26.2 R?#27.2)
NetU1#2_38: CANbus (U5#1.12), ComputeModule (U1#2.38)
NetU1#2_39: CANbus (U5#1.16), ComputeModule (U1#2.39)
NetU1#2_40: CANbus (U5#1.15), ComputeModule (U1#2.40)
NetU1#2_44: CANbus (U5#1.14), ComputeModule (U1#2.44)
NetU1#2_102: EthernetBridge (U16.66), ComputeModule (U1#2.102)
NetU1#2_109: EthernetBridge (U16.68), ComputeModule (U1#2.109)
NetU1#2_110: EthernetBridge (U16.36), ComputeModule (U1#2.110)
NetU1#2_112: EthernetBridge (U16.37), ComputeModule (U1#2.112)
NetU1#2_116: EthernetBridge (U16.30), ComputeModule (U1#2.116)
NetU1#2_118: EthernetBridge (U16.32), ComputeModule (U1#2.118)
NetU1#2_122: EthernetBridge (U16.27), ComputeModule (U1#2.122)
NetU1#2_124: EthernetBridge (U16.28), ComputeModule (U1#2.124)
NetU5#2_125: NetworkSwitch (U5#2.125), EthernetBridge (U16.64)